# Altium schematic sheet Connectors.SchDoc
size A4; CompanyName: Technische Hochschule Nürnberg Georg Simon Ohm; Organization: UltraZohm; Address1: Kesslerplatz 12; Address2: 90489 Nürnberg; Address3: GERMANY; DocumentNumber: 2; SheetNumber: 2; SheetTotal: 2; Website: www.ultrazohm.com
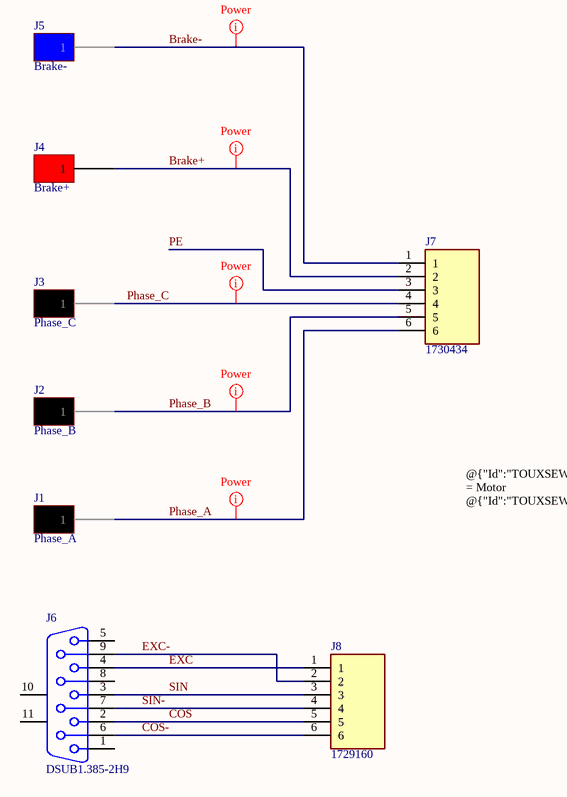
[diagram p0: Connectors.SchDoc]

## Parts
J1  Phase_A  [FCR7350]
J2  Phase_B  [FCR7350]
J3  Phase_C  [FCR7350]
J4  Brake+  [FCR7350]
J5  Brake-  [FCR7350]
J6  DSUB1.385-2H9  [DSUB1.385-2H9]
J7  1730434  [1730434]
J8  1729160  [1729160]

## Nets
Brake+: J4.1 J7.2
Brake-: J5.1 J7.1
COS: J6.2 J8.5
COS-: J6.6 J8.6
EXC: J6.4 J8.1
EXC-: J6.9 J8.2
PE: J7.3
Phase_A: J1.1 J7.6
Phase_B: J2.1 J7.5
Phase_C: J3.1 J7.4
SIN: J6.3 J8.3
SIN-: J6.7 J8.4

Not connected (* = marked no-connect by the designer): J6 1 5 8 10(MH1) 11(MH2)

## Layout directives
net class Power: Brake+, Brake-, Phase_A, Phase_B, Phase_C

## Notes on the sheet
- @{"Id":"TOUXSEWW\IYUTKTJL"} = Motor
  @{"Id":"TOUXSEWW\ALGEYMEH"} = Encoder
- Title
- Revision:
- Design Engineer:
- Date:
- Project:
- Sheet
- of

## Library data of the parts
J1-J3 = FCR7350B: FCR7350B, 1000V, 24A, BLACK; Manufacturer: Cliff; Value: PCB mount 4mm jack, Black	FCR7350B, 1000V, 24A; Created from: DHufnagel; Manufacturer Part Number: FCR7350B; PartID: 6; Created On: 13.06.2022 10:18:11; ComponentLink1Description: datasheet; ComponentLink1URL: https://www.cliffuk.co.uk/products/testleads/sockets/S16NPC.pdf; ComponentLink2Description: drawing; ComponentLink2URL: https://media.digikey.com/pdf/Data%20Sheets/Cliff%20Electronic%20LTD%20PDF's/FCR7350_Drawing.pdf; Component Type: PCB mount 4mm jack, Black; Device Package: THT; Last Updated: 28.06.2022 13:58:37; Minimum Order: 1; Mounting Type: THT; Operating Temperature: -40°C - 80°C; Series: S16N-PC; Supplier 1: Digi-Key; Supplier Part Number 1: 3185-FCR7350B-ND; Supplier 2: farnell; Supplier Part Number 2: 1854507; Type: PCB mount 4mm jack, Black	FCR7350B, 1000V, 24A; Live Cycle Status: 1; Stock number: not stored
J4 = FCR7350R: FCR7350B, 1000V, 24A, RED; Manufacturer: Cliff; Value: PCB mount 4mm jack, Red FCR7350R, 1000V, 24A; Created from: DHufnagel; Manufacturer Part Number: FCR7350R; PartID: 7; Created On: 13.06.2022 10:18:11; ComponentLink1Description: datasheet; ComponentLink1URL: https://www.cliffuk.co.uk/products/testleads/sockets/S16NPC.pdf; ComponentLink2Description: drawing; ComponentLink2URL: https://media.digikey.com/pdf/Data%20Sheets/Cliff%20Electronic%20LTD%20PDF's/FCR7350_Drawing.pdf; Component Type: PCB mount 4mm jack, Red; Device Package: THT; Last Updated: 28.06.2022 13:58:37; Minimum Order: 1; Mounting Type: THT; Operating Temperature: -40°C - 80°C; Series: S16N-PC; Supplier 1: Digi-Key; Supplier Part Number 1: 3185-FCR7350R-ND; Supplier 2: farnell; Supplier Part Number 2: 1854508; Type: PCB mount 4mm jack, Red FCR7350R, 1000V, 24A; Live Cycle Status: 1; Stock number: not stored
J5 = FCR7350L: FCR7350B, 1000V, 24A, BLUE; Manufacturer: Cliff; Value: PCB mount 4mm jack, Blue FCR7350L, 1000V, 24A; Created from: DHufnagel; Manufacturer Part Number: FCR7350L; PartID: 8; Created On: 13.06.2022 10:18:11; ComponentLink1Description: datasheet; ComponentLink1URL: https://www.cliffuk.co.uk/products/testleads/sockets/S16NPC.pdf; ComponentLink2Description: drawing; ComponentLink2URL: https://media.digikey.com/pdf/Data%20Sheets/Cliff%20Electronic%20LTD%20PDF's/FCR7350_Drawing.pdf; Component Type: PCB mount 4mm jack, Blue; Device Package: THT; Last Updated: 28.06.2022 13:58:37; Minimum Order: 1; Mounting Type: THT; Operating Temperature: -40°C - 80°C; Series: S16N-PC; Supplier 1: Digi-Key; Supplier Part Number 1: 3185-FCR7350L-ND; Supplier 2: farnell; Supplier Part Number 2: 1854511; Type: PCB mount 4mm jack, Blue FCR7350L, 1000V, 24A; Live Cycle Status: 1; Stock number: not stored
J6 = DSUB1.385-2H9: Connector; D Subminiature; 9 Position; Right Angle; Pitch 1.385 mm; Manufacturer: TE Connectivity; PackageDocument: O; Positions: 9; Gender: Receptacle; Created from: MHlatky; Published: 15-Jun-2001; LatestRevisionDate: 17-Jul-2002; LatestRevisionNote: Re-released for DXP Platform.; DatasheetDocument: 1-Sep-1999; PackageReference: 788750; Publisher: Altium Limited; Orientation: Right Angle; Manufacturer Part Number: DSUB1.385-2H9; PartID: 5; Created On: 26.01.2021 09:19:51; ComponentLink1Description: Datasheet; ComponentLink1URL: https://www.mouser.de/datasheet/2/418/7/ENG_CD_2311765_D-2072985.pdf; Component Type: DSUB Connector; Device Package: -; Last Updated: 27.05.2022 15:54:50; Supplier 1: Mouser; Supplier Part Number 1: 571-2311765-1; Type: DSUB Connector; Live Cycle Status: 1; LCSC Part Number: C141882; Stock number: not stored
J7 = 1730434: Fixed Mounting Block, 6 Pins, 5.08mm Pitch, 26-14 AWG; Manufacturer: Phoenix Contact; Created from: DHufnagel; Number of positions: 6; Manufacturer Part Number: 1730434; PartID: 55; Created On: 20.04.2023 12:39:10; ComponentLink1Description: Homepage; ComponentLink1URL: https://www.phoenixcontact.com/us/products/1730434/pdf; Component Type: Phoenix Connector; Device Package: Connector; Last Updated: 20.04.2023 12:39:10; Mounting Type: THT; Operating Temperature: -40 - 105  °C; Supplier 1: Mouser; Supplier Part Number 1: 651-1730434; Type: Connector; Live Cycle Status: 1; Number of rows: 1; Stock number: not stored
J8 = 1729160: Fixed Mounting Block, 6 Pins, 5.08mm Pitch, 26-16 AWG; Manufacturer: Phoenix Contact; Created from: DHufnagel; Number of positions: 6; Manufacturer Part Number: 1729160; PartID: 56; Created On: 20.04.2023 12:39:10; ComponentLink1Description: Homepage; ComponentLink1URL: https://www.phoenixcontact.com/us/products/1729160/pdf; Component Type: Phoenix Connector; Device Package: Connector; Last Updated: 20.04.2023 12:48:08; Mounting Type: THT; Operating Temperature: -40 - 100  °C; Supplier 1: Mouser; Supplier Part Number 1: 651-1729160; Type: Connector; Live Cycle Status: 1; Number of rows: 1; Stock number: not stored